# Altium schematic sheet 03PERIPHERALS.SchDoc
size A3; SheetNumber: 3
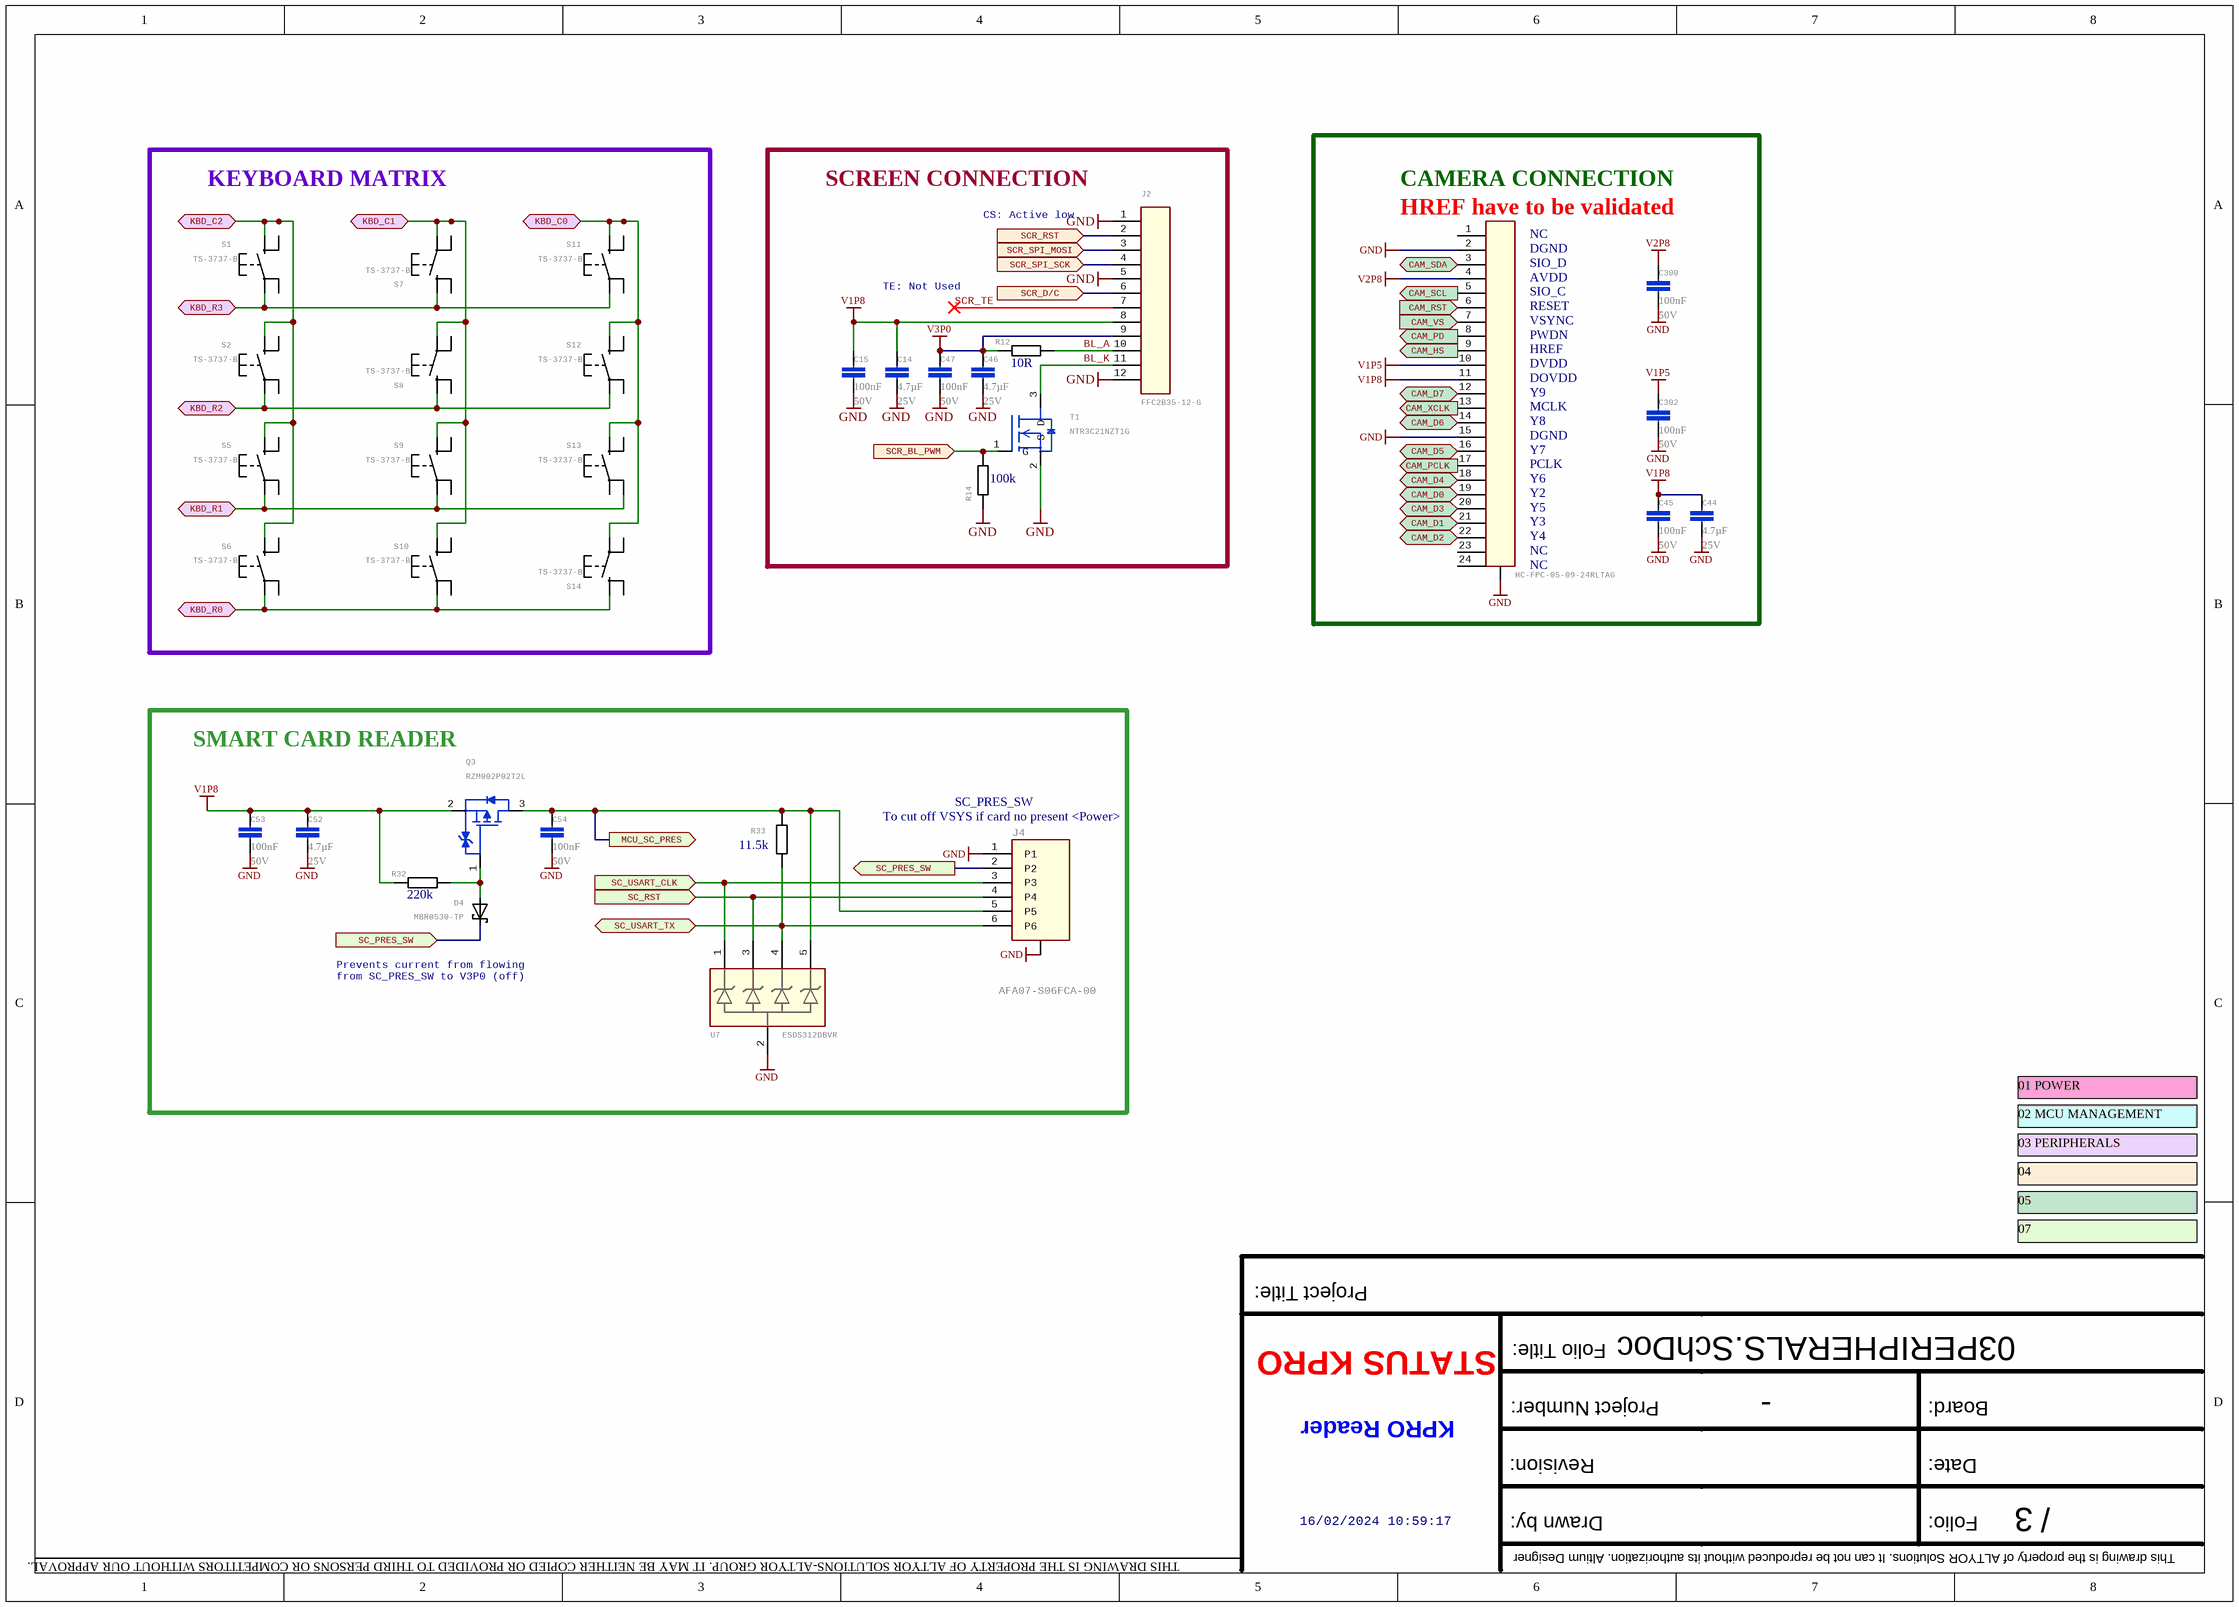
[diagram p0: 03PERIPHERALS.SchDoc]

## Parts
C14  VOLTAGE: 25V  NAME: 4.7µF  [0805 - CAPACITOR]  (hidden comment: 0805X475M250CT)
C15  VOLTAGE: 50V  NAME: 100nF  [0402 - CAPACITOR]  (hidden comment: 0402B104K500CT)
C44  VOLTAGE: 25V  NAME: 4.7µF  [0805 - CAPACITOR]  (hidden comment: 0805X475M250CT)
C45  VOLTAGE: 50V  NAME: 100nF  [0402 - CAPACITOR]  (hidden comment: 0402B104K500CT)
C46  VOLTAGE: 25V  NAME: 4.7µF  [0805 - CAPACITOR]  (hidden comment: 0805X475M250CT)
C47  VOLTAGE: 50V  NAME: 100nF  [0402 - CAPACITOR]  (hidden comment: 0402B104K500CT)
C52  VOLTAGE: 25V  NAME: 4.7µF  [0805 - CAPACITOR]  (hidden comment: 0805X475M250CT)
C53  VOLTAGE: 50V  NAME: 100nF  [0402 - CAPACITOR]  (hidden comment: 0402B104K500CT)
C54  VOLTAGE: 50V  NAME: 100nF  [0402 - CAPACITOR]  (hidden comment: 0402B104K500CT)
C300  VOLTAGE: 50V  NAME: 100nF  [0402 - CAPACITOR]  (hidden comment: 0402B104K500CT)
C302  VOLTAGE: 50V  NAME: 100nF  [0402 - CAPACITOR]  (hidden comment: 0402B104K500CT)
D4  MBR0530-TP  [SOD123 DIODE INC]
J2  FFC2B35-12-G  [GCT FFC2B35-12-G]
J4  AFA07-S06FCA-00  [JUSHUO AFA07-S15FCC-00]
Q3  RZM002P02T2L  [SOT-723]
R12  NAME: 10R  [0402 - RESISTOR]  (hidden comment: RC0402FR-0710RL)
R14  NAME: 100k  [0402 - RESISTOR]  (hidden comment: RC0402FR-07100KL)
R32  NAME: 220k  [0402 - RESISTOR]  (hidden comment: RC0402FR-07220KL)
R33  NAME: 11.5k  [0402 - RESISTOR]  (hidden comment: RC0402FR-0711K5L)
S1  TS-3737-B  [XKB TS3-737]
S2  TS-3737-B  [XKB TS3-737]
S5  TS-3737-B  [XKB TS3-737]
S6  TS-3737-B  [XKB TS3-737]
S7  TS-3737-B  [XKB TS3-737]
S8  TS-3737-B  [XKB TS3-737]
S9  TS-3737-B  [XKB TS3-737]
S10  TS-3737-B  [XKB TS3-737]
S11  TS-3737-B  [XKB TS3-737]
S12  TS-3737-B  [XKB TS3-737]
S13  TS-3737-B  [XKB TS3-737]
S14  TS-3737-B  [XKB TS3-737]
T1  NTR3C21NZT1G  [SOT23-VAR AB]
U7  ESDS312DBVR  [SOT95P270X145-5N]
X1  HC-FPC-05-09-24RLTAG  [HCTL HC-FPC-05-09-24RLTAG]

## Blocks framed on the sheet
KEYBOARD MATRIX: S1 S2 S5-S14
SCREEN CONNECTION: C14 C15 C46 C47 J2 R12 R14 T1
SMART CARD READER: C52-C54 D4 J4 Q3 R32 R33 U7

## Ports
CAM_D0, CAM_D1, CAM_D2, CAM_D3, CAM_D4, CAM_D5, CAM_D6, CAM_D7, CAM_HS, CAM_PCLK, CAM_PD, CAM_RST, CAM_SCL, CAM_SDA, CAM_VS, CAM_XCLK, KBD_C0, KBD_C1, KBD_C2, KBD_R0, KBD_R1, KBD_R2, KBD_R3, MCU_SC_PRES, SC_PRES_SW, SC_RST, SC_USART_CLK, SC_USART_TX, SCR_BL_PWM, SCR_D/C, SCR_RST, SCR_SPI_MOSI, SCR_SPI_SCK

## Nets
GND: C14.2 C15.2 C44.2 C45.2 C46.2 C47.2 C52.2 C53.2 C54.2 C300.2 C302.2 J2.1 J2.5 J2.12 J4.0 J4.1(P1) R14.1 T1.2(S) U7.2 X1.0 X1.2 X1.15
V1P5: C302.1 X1.10
V1P8: C14.1 C15.1 C44.1 C45.1 C52.1 C53.1 J2.8 Q3.2(S) R32.1 X1.11
V2P8: C300.1 X1.4
V3P0: C46.1 C47.1 J2.9 R12.2
BL_A: J2.10 R12.1
BL_K: J2.11 T1.3(D)
CAM_D0: X1.19 ; port CAM_D0
CAM_D1: X1.21 ; port CAM_D1
CAM_D2: X1.22 ; port CAM_D2
CAM_D3: X1.20 ; port CAM_D3
CAM_D4: X1.18 ; port CAM_D4
CAM_D5: X1.16 ; port CAM_D5
CAM_D6: X1.14 ; port CAM_D6
CAM_D7: X1.12 ; port CAM_D7
CAM_HS: X1.9 ; port CAM_HS
CAM_PCLK: X1.17 ; port CAM_PCLK
CAM_PD: X1.8 ; port CAM_PD
CAM_RST: X1.6 ; port CAM_RST
CAM_SCL: X1.5 ; port CAM_SCL
CAM_SDA: X1.3 ; port CAM_SDA
CAM_VS: X1.7 ; port CAM_VS
CAM_XCLK: X1.13 ; port CAM_XCLK
KBD_C0: S11.A S12.A S13.A S14.C ; port KBD_C0
KBD_C1: S7.C S8.C S9.A S10.A ; port KBD_C1
KBD_C2: S1.A S2.A S5.A S6.A ; port KBD_C2
KBD_R0: S6.C S10.C S14.A ; port KBD_R0
KBD_R1: S5.C S9.C S13.D ; port KBD_R1
KBD_R2: S2.C S8.A S12.C ; port KBD_R2
KBD_R3: S1.C S7.A S11.C ; port KBD_R3
MCU_SC_PRES: C54.1 J4.5(P5) Q3.3(D) R33.2 U7.5 ; port MCU_SC_PRES
SC_PRES_SW: D4.C J4.2(P2) ; port SC_PRES_SW
SC_RST: J4.4(P4) U7.3 ; port SC_RST
SC_USART_CLK: J4.3(P3) U7.1 ; port SC_USART_CLK
SC_USART_TX: J4.6(P6) R33.1 U7.4 ; port SC_USART_TX
SCR_BL_PWM: R14.2 T1.1(G) ; port SCR_BL_PWM
SCR_D/C: J2.6 ; port SCR_D/C
SCR_RST: J2.2 ; port SCR_RST
SCR_SPI_MOSI: J2.3 ; port SCR_SPI_MOSI
SCR_SPI_SCK: J2.4 ; port SCR_SPI_SCK
SCR_TE: J2.7
NetD4_A: D4.A Q3.1(G) R32.2

Not connected (* = marked no-connect by the designer): S1 B D; S2 B D; S5 B D; S6 B D; S7 B D; S8 B D; S9 B D; S10 B D; S11 B D; S12 B D; S13 B C; S14 B D; X1 1 23 24

## Notes on the sheet
- (near X1) CAMERA CONNECTION
- CS: Active low
- (near X1) HREF have to be validated
- (near X1) NC
- (near X1) DGND
- TE: Not Used
- (near X1) SIO_D
- (near X1) AVDD
- (near X1) SIO_C
- (near X1) RESET
- (near X1) VSYNC
- (near X1) PWDN
- (near X1) HREF
- (near X1) DVDD
- (near X1) DOVDD
- (near X1) Y9
- (near X1) MCLK
- (near X1) Y8
- (near X1) Y7
- (near X1) PCLK
- (near X1) Y6
- (near X1) Y2
- (near X1) Y5
- (near X1) Y3
- (near X1) Y4
- (near J4) To cut off VSYS if card no present <Power>
- (near J4) SC_PRES_SW
- (near D4) Prevents current from flowing
  from SC_PRES_SW to V3P0 (off)
- 01 POWER
- 02 MCU MANAGEMENT
- 03 PERIPHERALS
- 04
- 07
- 05
- 16/02/2024 10:59:17
- STATUS KPRO
- Project Title:
- Folio Title:
- KPRO Reader
- Project Number:
- -
- Board:
- Revision:
- Date:
- THIS DRAWING IS THE PROPERTY OF ALTYOR SOLUTIONS-ALTYOR GROUP. IT MAY BE NEITHER COPIED OR PROVIDED TO THIRD PERSONS OR COMPETITORS WITHOUT OUR APPROVAL.
- Drawn by:
- Folio:
- /
- This drawing is the property of ALTYOR Solutions. It can not be reproduced without its authorization. Altium Designer

## Library data of the parts
C14 C44 C46 C52 = C-EU-C4.7µF-X5R-6.3V-0805: CAP X5R 4.7µF 25V ±10% 0805; MANUFACTURER: WALSIN; ARTICLE CODE: MSR 791-0805X475M250CT; GENERIC: True; ERP SF CODE: 4; ERP CODE: 10-*; TMAX: 125; TMIN: -55
C15 C45 C47 C53 C54 C300 C302 = C-EU-C100NF-X7R-16V-0402: CAP X7R 100nF 50V ±10% 0402; MANUFACTURER: WALSIN; ARTICLE CODE: MSR 791-0402B104K500CT; GENERIC: True; ERP SF CODE: 4; ERP CODE: 10-*; TMAX: 125; TMIN: -55
D4 = MBR0530T1G: Schottky Rectifier, 30 V, 500 mA, Single; pin to pad: A>2 C>1; MANUFACTURER: ON SEMI; ARTICLE CODE: MSR 863-MBR0530-TP; ERP CODE: MBR0530-*; GENERIC: False; TMIN: 125; TMAX: -65; NAME: MBR0530
J2 = FFC2B35-12-G: 0.5mm Side entry Flat Flexible Cable Connector, 12pin,  bottom contacts; MANUFACTURER: GCT; TMIN: -25; ARTICLE CODE: MSR 640-FFC2B35-12-G; GENERIC: False; ERP CODE: 10-*; ERP SF CODE: 14; TMAX: 85; NAME: FFC2B35-12-G
J4 = JUSHUO AFA07-S15FCC-00: Connecteurs FFC et FPC FFC/FPC 6 positions, 1mm, right angle, bottom contact; MANUFACTURER_CND: AFA07-S06FCC-00; MANUFACTURER: JUSHUO; TMAX: 105; ARTICLE CODE: LCSC C72727; GENERIC: False; ERP CODE: 10-*; ERP SF CODE: 11; NAME: 6x1; TMIN: -55
Q3 = RZM002P02T2L: MOS P 20V 200mA Rds1.2R; MANUFACTURER: ROHM SEMI; TMIN: -55; ARTICLE CODE: MSR 755-RZM002P02T2L; NAME: RZM002; TMAX: 150; GENERIC: False
R12 = R-EU-R10-1%-0402: RES 10R 63mW 1% 0402; MANUFACTURER: YAGEO; ARTICLE CODE: MSR 603-RC0402FR-0710RL; GENERIC: True; TMIN: -55; TMAX: 150
R14 = R-EU-R100K-1%-0402: RES 100k 63mW 1% 0402; MANUFACTURER: YAGEO; ARTICLE CODE: MSR 603-RC0402FR-07100KL; GENERIC: True; TMIN: -55; TMAX: 150
R32 = R-EU-R220K-1%-0402: RES 220k 63mW 1% 0402; MANUFACTURER: YAGEO; ARTICLE CODE: MSR 603-RC0402FR-07220KL; GENERIC: True; TMIN: -55; TMAX: 150
R33 = R-EU-R11.5K-1%-50V-0402: RES 11k5 63mW 1% 0402; MANUFACTURER: YAGEO; ARTICLE CODE: MSR 603-RC0402FR-0711K5L; GENERIC: True; TMIN: -55; TMAX: 150
S1 S2 S5-S14 = XKB TS3737: Switch 160gr; MANUFACTURER: XKB; REFERENCE: TS-3737-A; GENERIC: False; TMAX: 100; ERP CODE: 10-*; TMIN: -40; NAME: TS3737
T1 = NTR3C21NZT1G: MOS N 20V 3.6A Rds24mR - SOT23; MANUFACTURER: ON SEMI; MANUFACTURE_CND: BSS138N / NTR3C21NZT1G; GENERIC: False; TMAX: 150; ARTICLE CODE: MSR 863-NTR3C21NZT1G; ERP CODE: 10-*; TMIN: -55; NAME: NTR3C21
U7 = ESDS312DBVR: 3.6V Data-Line Surge and 30kV ESD Protection Diode Array 5-SOT-23 -40 to 125; MANUFACTURER: TEXAS; ERP CODE: 10-*; GENERIC: True; ERP SF CODE: 4; ARTICLE CODE: MSR 595-ESDS312DBVR; TMAX: 125; REFERENCE: ESDS312DBVR; TMIN: -40; NAME: ESDS312DBVR
X1 = HCTL HC-FPC-05-09-24RLTAG: 0.5mm Side entry Flat Flexible Cable Connector, 12pin,  bottom contacts; MANUFACTURER: HCTL; TMIN: -25; ARTICLE CODE: LCSC C5213757; GENERIC: False; ERP CODE: 10-*; ERP SF CODE: 14; NAME: 24x0.5; TMAX: 85